# Altium schematic sheet SquarePS.SchDoc
size A4
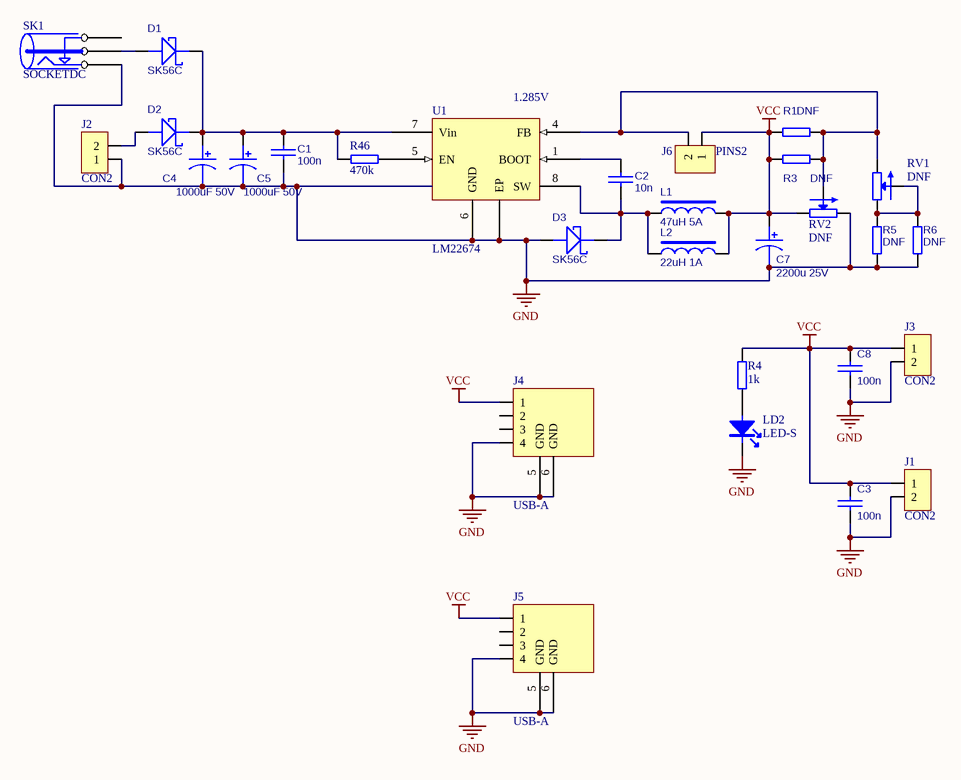
[diagram p0: SquarePS.SchDoc]

## Parts
C1  100n  [0603]
C2  10n  [0603]
C3  100n  [0603]
C4  1000uF 50V  [RB.3/.7]
C5  1000uF 50V  [RB.3/.7]
C7  2200u 25V  [RB.2/.5]
C8  100n  [0603]
D1  SK56C  [SMC]
D2  SK56C  [SMC]
D3  SK56C  [SMC]
J1  CON2  [Terms5mm2]
J2  CON2  [Terms5mm2]
J3  CON2  [Terms5mm2]
J4  USB-A  [USB_A]
J5  USB-A  [USB_A]
J6  PINS2  [SIP2]
L1  47uH 5A  [Inductor370x930]
L2  22uH 1A  [INDUCTOR6B]
LD2  LED-S  [0805Diode]
R1  DNF  [0603]
R3  DNF  [0603]
R4  1k  [0603]
R5  DNF  [0603]
R6  DNF  [0603]
R46  470k  [0603]
RV1  DNF  [VR3362P]
RV2  DNF  [VR3362P]
SK1  SOCKETDC  [SKTPWR]
U1  LM22674  [PSOP-8]

## Nets
GND: C1.1 C3.2 C4.2 C5.2 C7.2 C8.2 D3.A J1.2 J2.1 J3.2 J4.4 J4.5(GND) J4.6(GND) J5.4 J5.5(GND) J5.6(GND) LD2.K R5.1 R6.1 RV2.CW SK1.COM U1.6(GND) U1.9(EP)
VCC: C3.1 C7.1 C8.1 J1.1 J3.1 J4.1 J5.1 J6.1 L1.1 L2.2 R1.2 R3.2 R4.1 RV2.CCW
NetC1_2: C1.2 C4.1 C5.1 D1.K D2.K R46.2 U1.7(Vin)
NetC2_1: C2.1 U1.1(BOOT)
NetC2_2: C2.2 D3.K L1.2 L2.1 U1.8(SW)
NetD1_A: D1.A SK1.PIN
NetD2_A: D2.A J2.2
NetJ6_2: J6.2 R1.1 R3.1 RV1.CW RV2.W U1.4(FB)
NetLD2_A: LD2.A R4.2
NetR5_2: R5.2 R6.2 RV1.CCW RV1.W
NetR46_1: R46.1 U1.5(EN)

Not connected (* = marked no-connect by the designer): J4 2 3; J5 2 3; SK1 SW

## Notes on the sheet
- (near U1) 1.285V

## Library data of the parts
C1-C3 C8 = CAP
C4 C5 C7 = CAPACITOR POL
D1-D3 = DIODE SCHOTTKY
J6 = CON2
L1 L2 = INDUCTOR2: Part Field 1: Electus LF-1402
LD2 = LED-S: LED
R1 R3-R6 R46 = RES8
RV1 RV2 = RES6
SK1 = SOCKETDC: DC Power Connector
U1 = LM22675: 1A SMPS